# EAGLE board Sequencer-Memory-V2.1 (EAGLE 9.6.2)
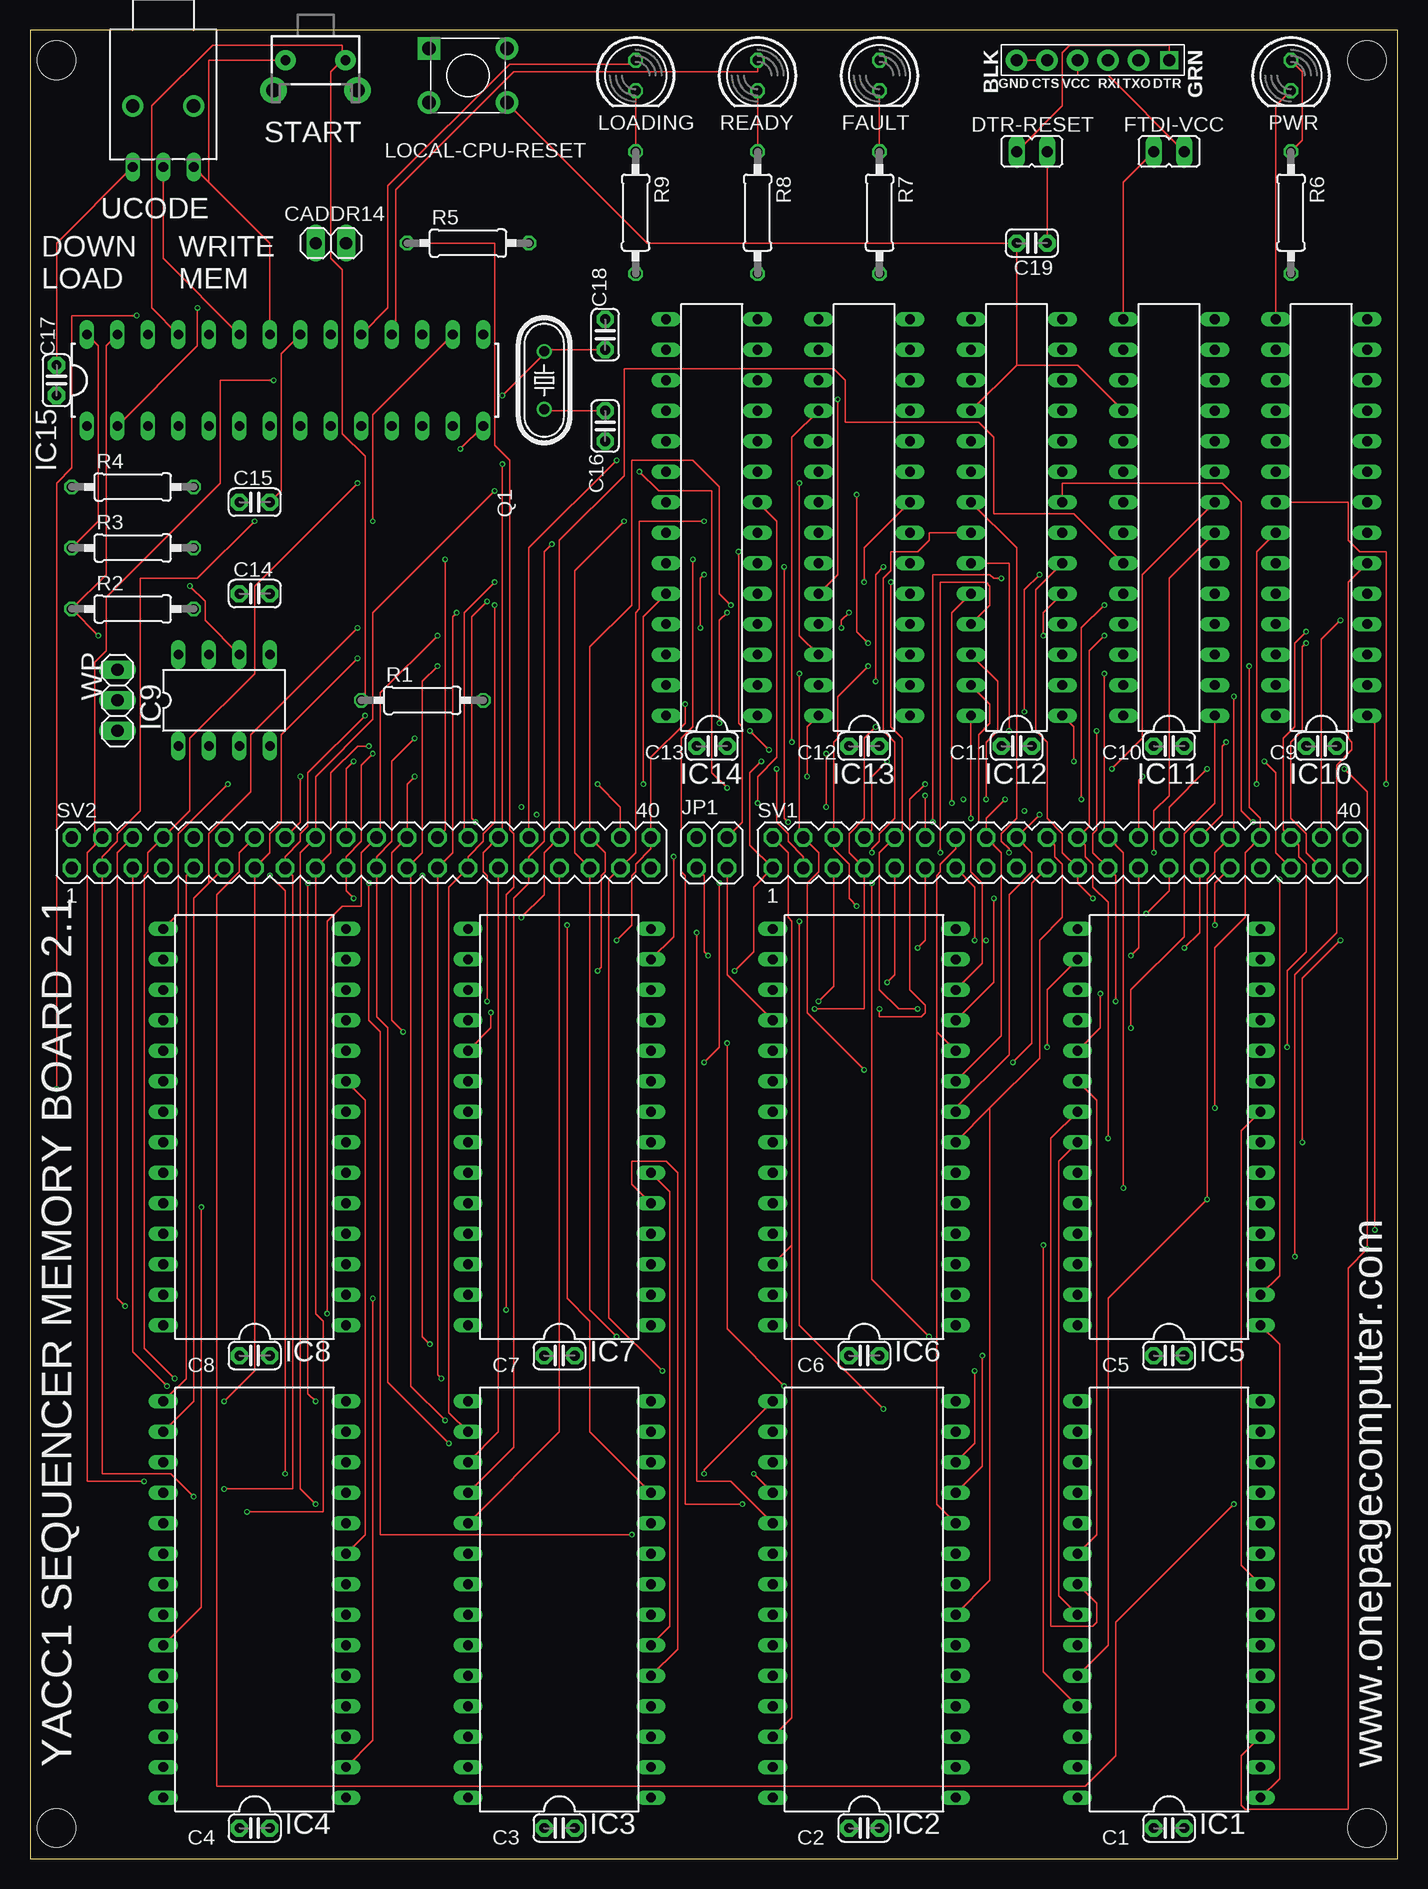
[diagram p4: board, top side]
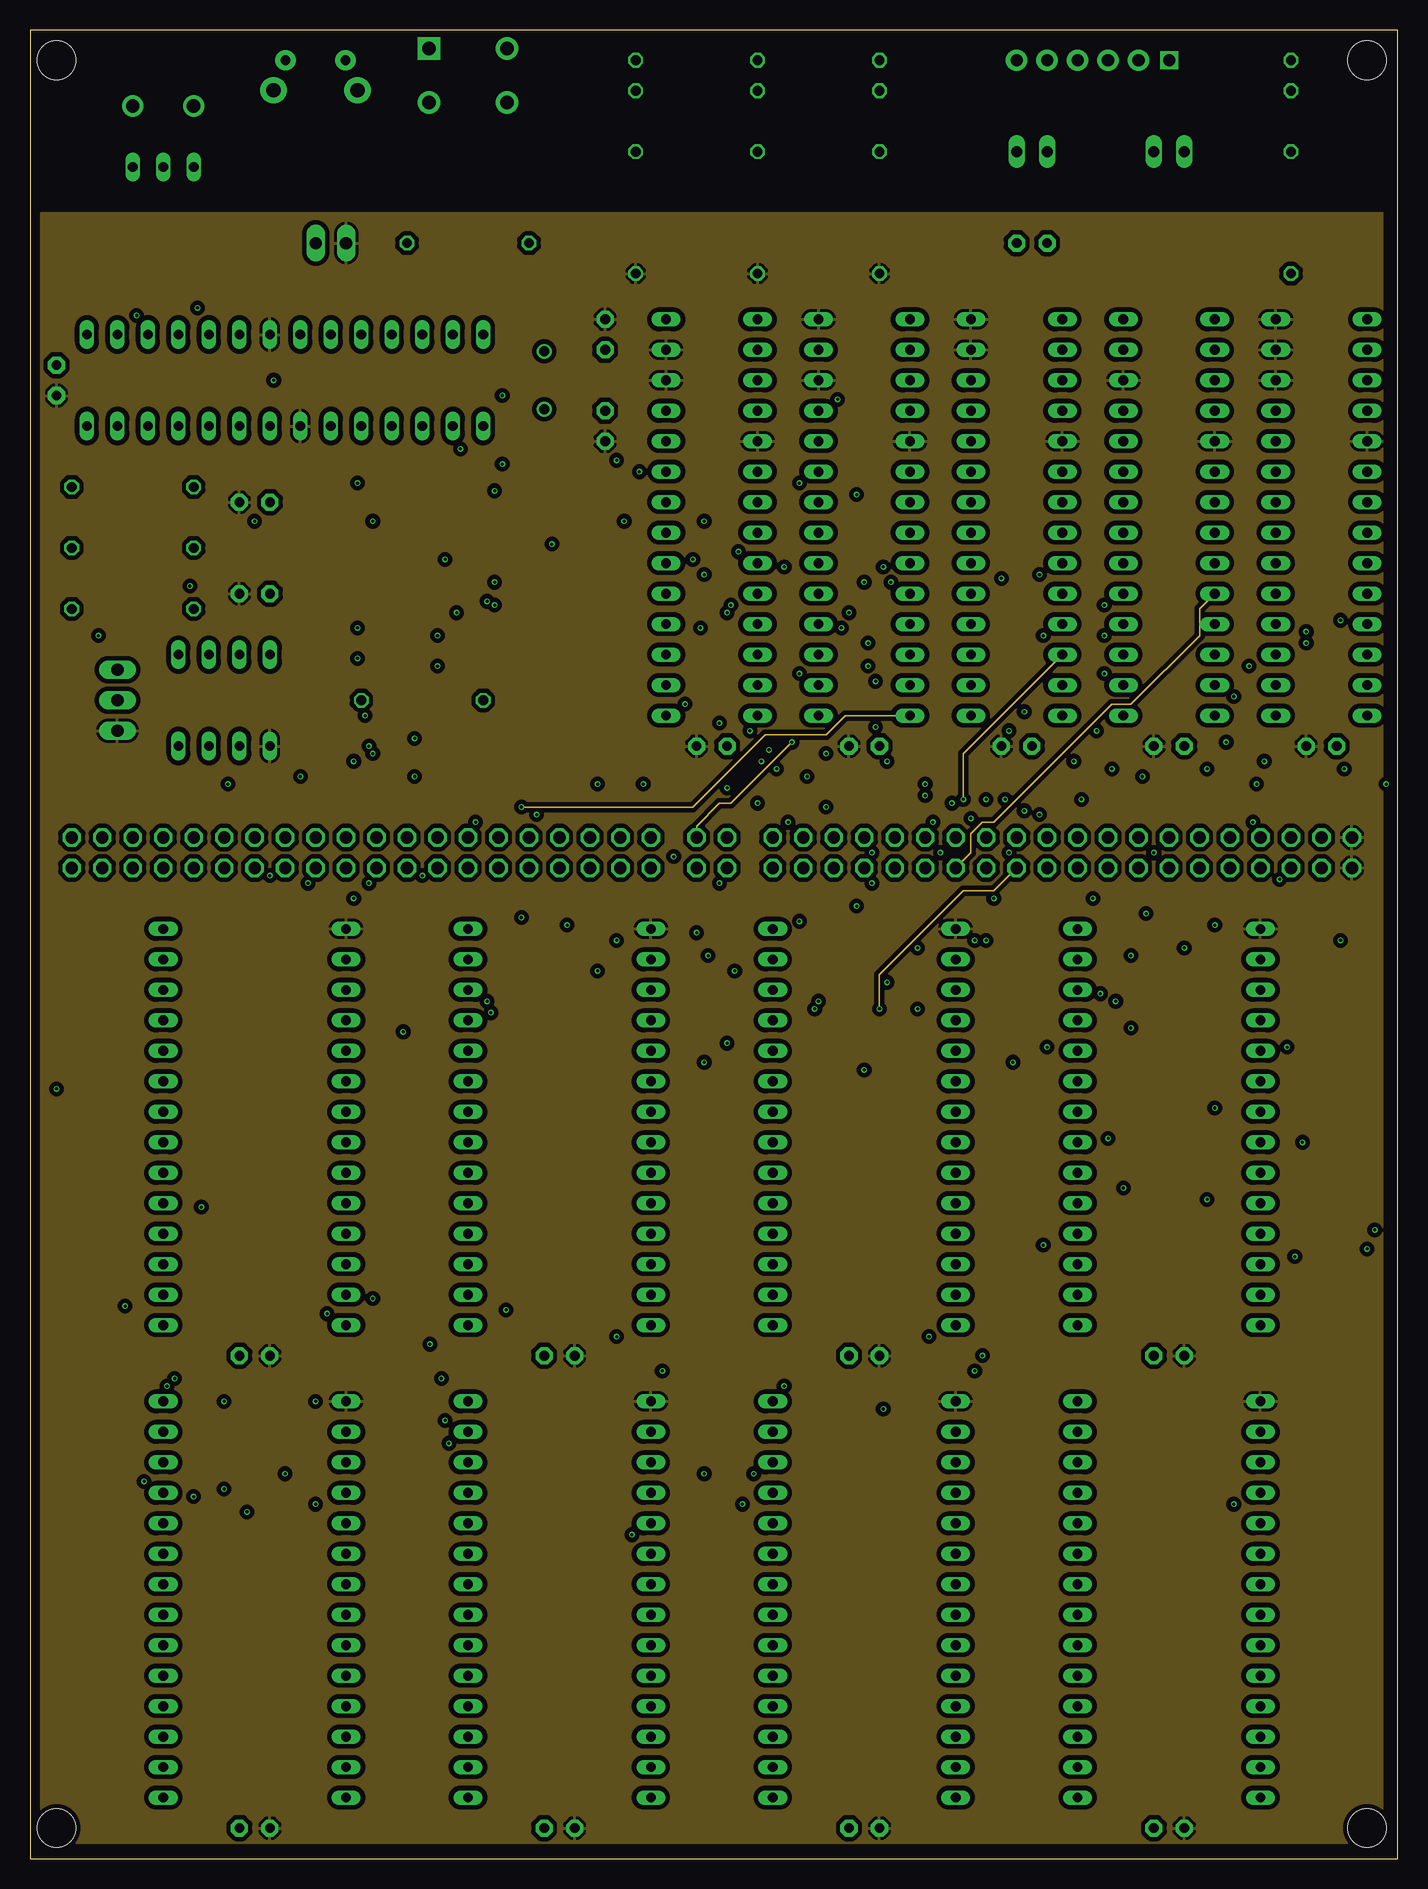
[diagram p5: board, inner layer Route2]
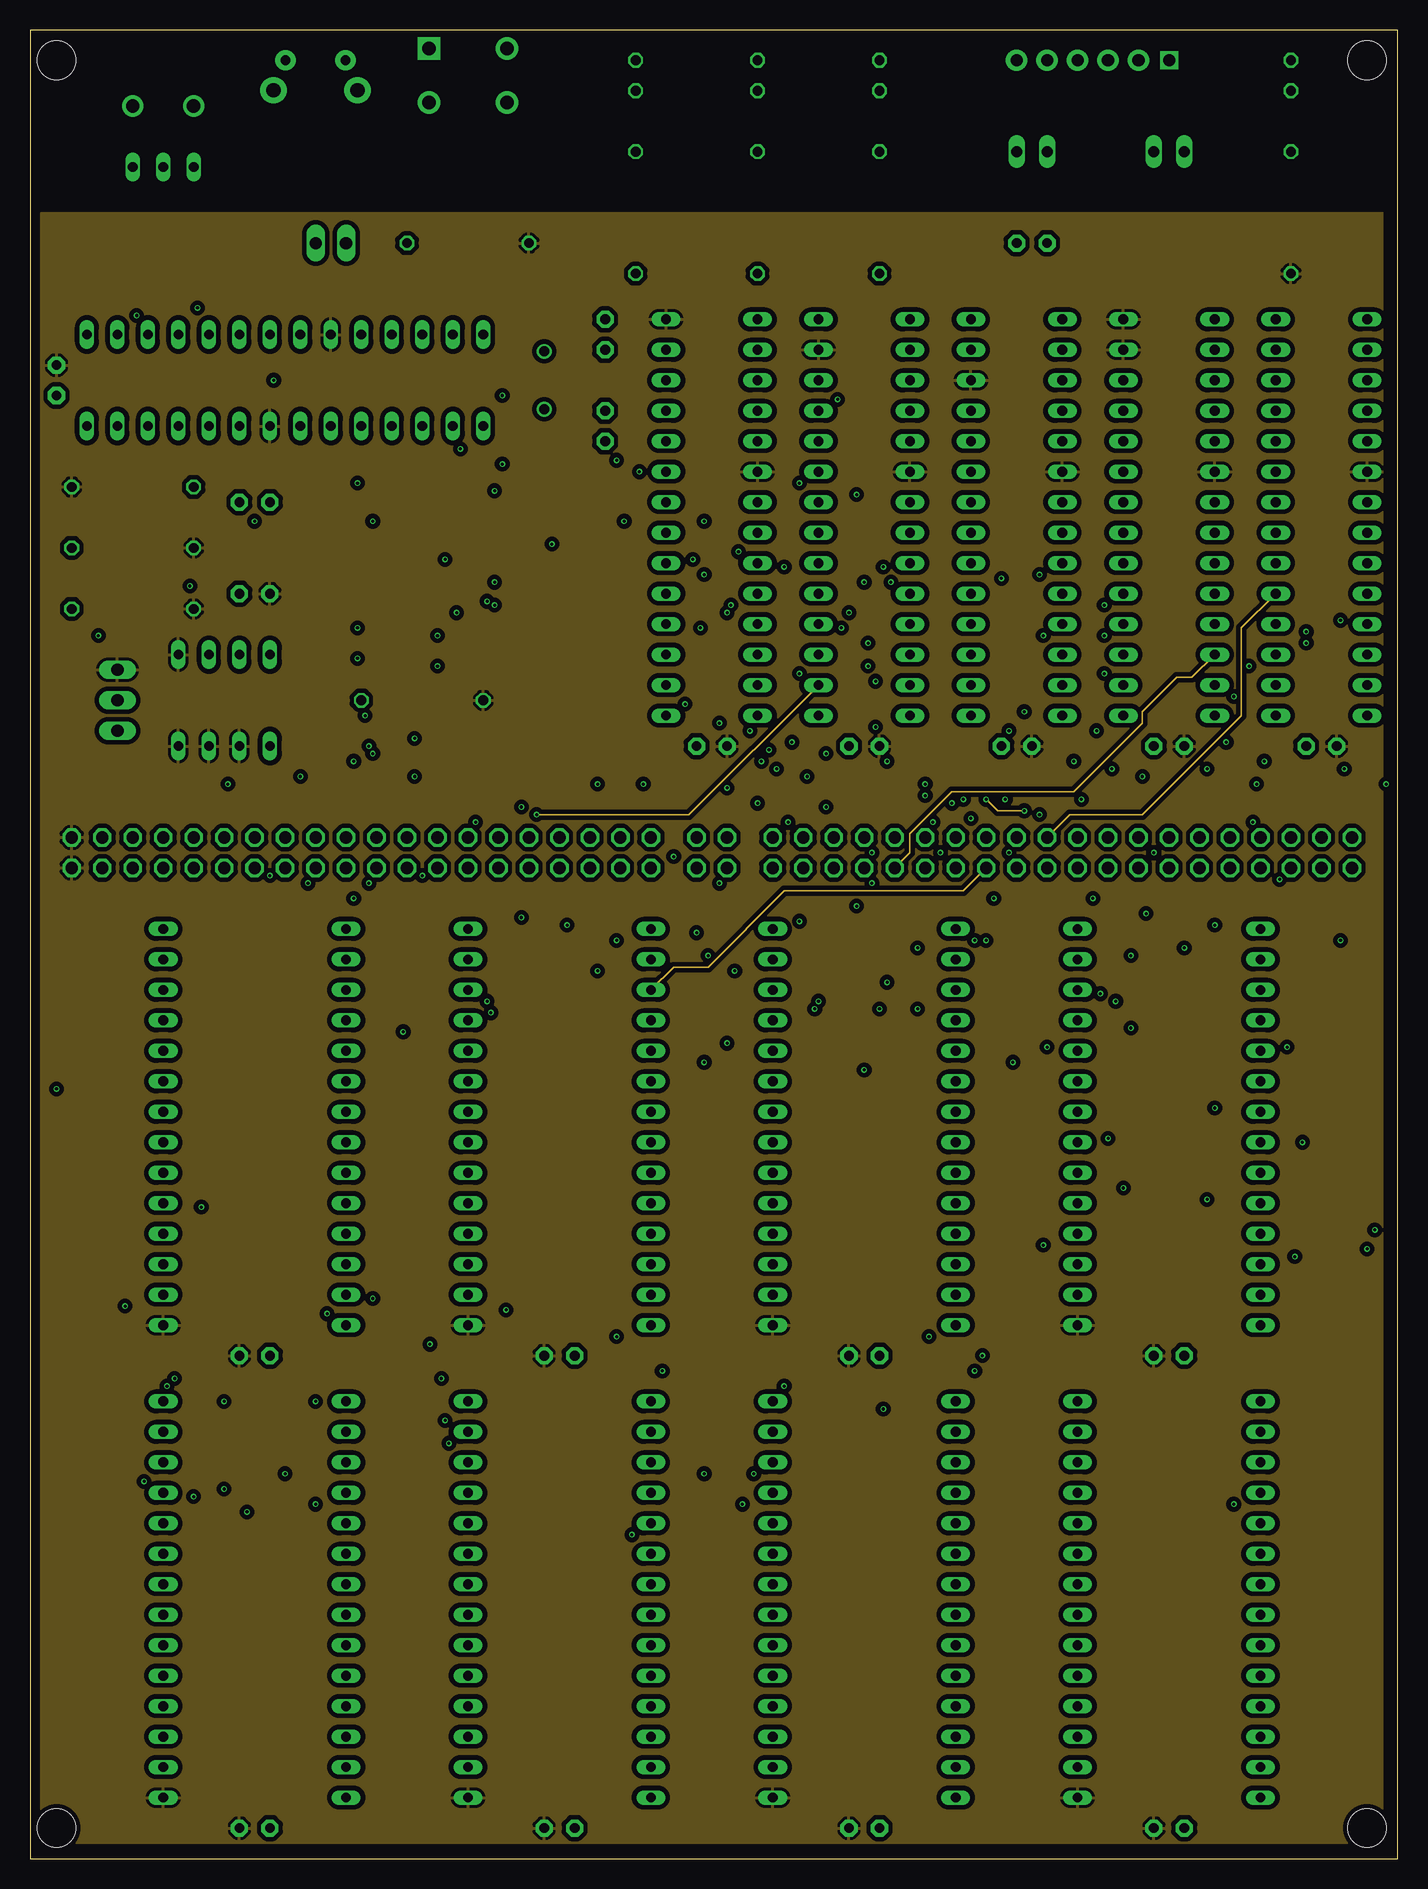
[diagram p6: board, inner layer Route15]
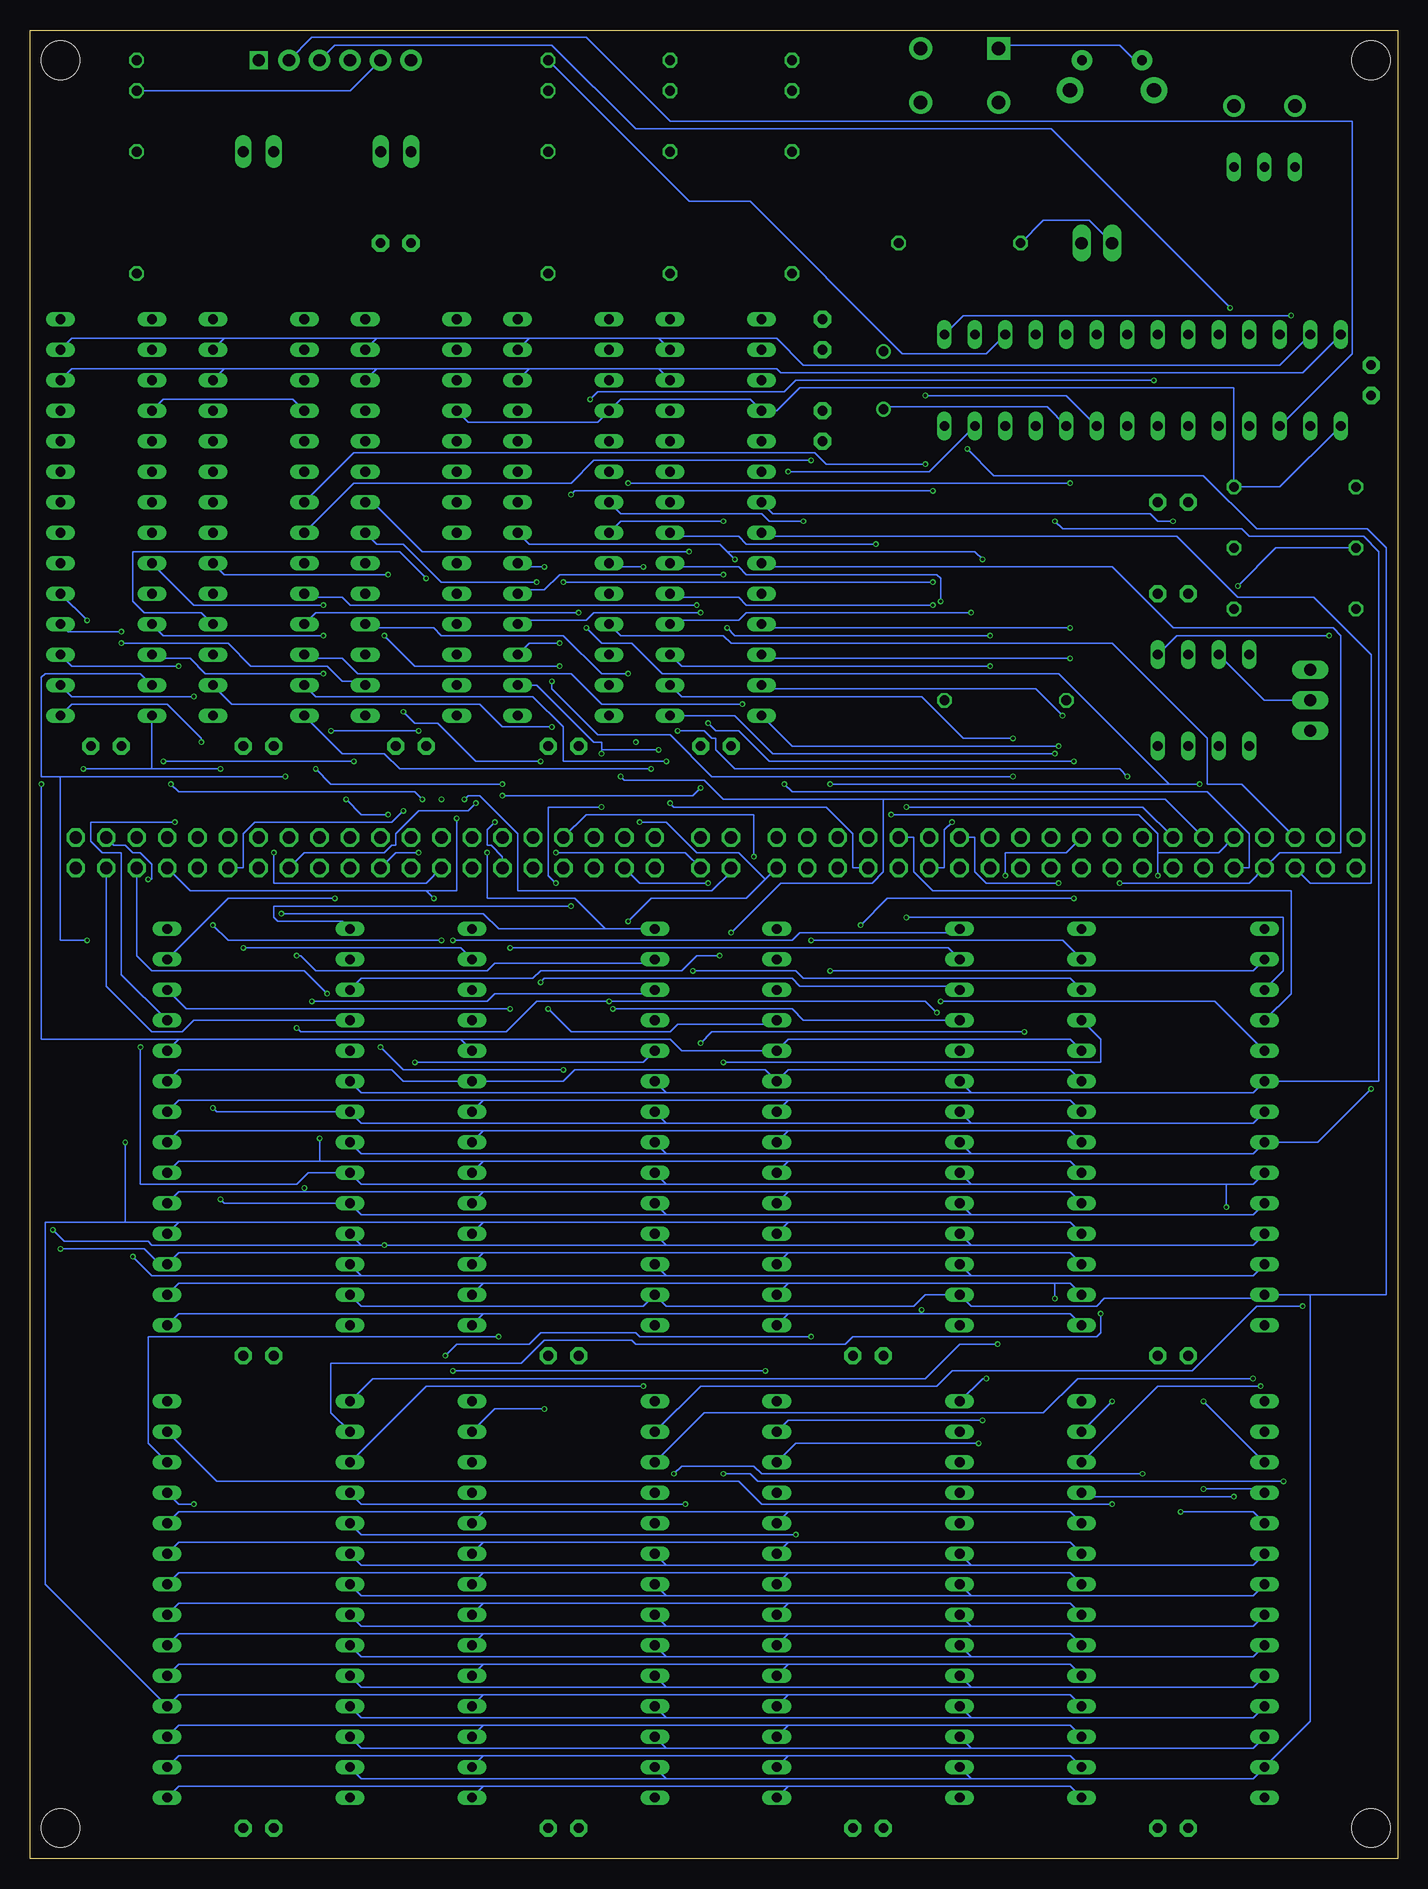
[diagram p7: board, bottom side, seen from below]

Size 113.97 x 152.38 mm. Coordinates in mm from the lower left corner, seen from the top.
Outline: 113.97,0 113.97,152.38 0,152.38 0,0 113.97,0
Copper layers (1*2*15*16): Top 0.035559375mm / dielectric 0.17018125mm / Route2 0.01778125mm / dielectric 47mil / Route15 0.01778125mm / dielectric 0.17018125mm / Bottom 0.035559375mm
Design rules "oshpark-4layer *": minimum track width 5mil, minimum drill 10mil, track to track 15mil, track to pad 10mil, pad to pad 10mil, via to via 5mil, smd to smd 5mil, copper to edge 15mil, drill to drill 6mil, minimum pad ring 4mil, minimum via ring 4mil, stop-mask expansion 2.5mil, vias tented up to drill 0mil, thermal gap 10mil
Holes 3.2 mm at 111.43,2.54 111.43,149.86 2.21,149.86 2.21,2.54

## Footprints (pad centres in the part's own frame; a part is rotated, then mirrored left to right if it is on the bottom)
C025-024X044 = drill 0.813 pad 1.422 octagon: 1 -1.27,0; 2 1.27,0
1X02 = drill 1.016 long: 1 -1.27,0; 2 1.27,0
JP1 = drill 0.914 long: 1 0,-1.27; 2 0,1.27
LED5MM = drill 0.813 octagon: A -1.27,0; K 1.27,0
DIL28-6 = drill 0.813 long: 1 -16.51,-7.62; 2 -13.97,-7.62; 3 -11.43,-7.62; 4 -8.89,-7.62; 5 -6.35,-7.62; 6 -3.81,-7.62; 7 -1.27,-7.62; 8 1.27,-7.62; 9 3.81,-7.62; 10 6.35,-7.62; 11 8.89,-7.62; 12 11.43,-7.62; 13 13.97,-7.62; 14 16.51,-7.62; 15 16.51,7.62; 16 13.97,7.62; 17 11.43,7.62; 18 8.89,7.62; 19 6.35,7.62; 20 3.81,7.62; 21 1.27,7.62; 22 -1.27,7.62; 23 -3.81,7.62; 24 -6.35,7.62; 25 -8.89,7.62; 26 -11.43,7.62; 27 -13.97,7.62; 28 -16.51,7.62
DIL8 = drill 0.813 long: 1 -3.81,-3.81; 2 -1.27,-3.81; 3 1.27,-3.81; 4 3.81,-3.81; 5 3.81,3.81; 6 1.27,3.81; 7 -1.27,3.81; 8 -3.81,3.81
DIL28-3 = drill 0.813 long: 1 -16.51,-3.81; 2 -13.97,-3.81; 3 -11.43,-3.81; 4 -8.89,-3.81; 5 -6.35,-3.81; 6 -3.81,-3.81; 7 -1.27,-3.81; 8 1.27,-3.81; 9 3.81,-3.81; 10 6.35,-3.81; 11 8.89,-3.81; 12 11.43,-3.81; 13 13.97,-3.81; 14 16.51,-3.81; 15 16.51,3.81; 16 13.97,3.81; 17 11.43,3.81; 18 8.89,3.81; 19 6.35,3.81; 20 3.81,3.81; 21 1.27,3.81; 22 -1.27,3.81; 23 -3.81,3.81; 24 -6.35,3.81; 25 -8.89,3.81; 26 -11.43,3.81; 27 -13.97,3.81; 28 -16.51,3.81
2X02 = drill 1.016 octagon: 1 -1.27,-1.27; 2 -1.27,1.27; 3 1.27,-1.27; 4 1.27,1.27
1X03 = drill 1.016 long: 1 -2.54,0; 2 0,0; 3 2.54,0
FTDI_DEVICE_SIDE = drill 1 square: P$1 -6.35,0 | drill 1.016 pad 1.778: P$2 -3.81,0; P$3 -1.27,0; P$4 1.27,0; P$5 3.81,0; P$6 6.35,0
SW4-6.2X6.2X5.0MM = drill 1.143 pad 1.905 square: 1 -3.25,2.25 | drill 1.143 pad 1.905: 2 -3.25,-2.25; 3 3.25,-2.25; 4 3.25,2.25
HC49/S = drill 0.813: 1 -2.413,0; 2 2.413,0
0207/10 = drill 0.813 octagon: 1 -5.08,0; 2 5.08,0
TACTILE-PTH-SIDEEZ = drill 0.8 pad 1.7: 1 -2.5,0; 2 2.5,0 | drill 1.2 pad 2.2: ANCHOR1 -3.5,2.5; ANCHOR2 3.5,2.5
MA20-2 = drill 1.016 octagon: 1 -24.13,-1.27; 2 -24.13,1.27; 3 -21.59,-1.27; 4 -21.59,1.27; 5 -19.05,-1.27; 6 -19.05,1.27; 7 -16.51,-1.27; 8 -16.51,1.27; 9 -13.97,-1.27; 10 -13.97,1.27; 11 -11.43,-1.27; 12 -11.43,1.27; 13 -8.89,-1.27; 14 -8.89,1.27; 15 -6.35,-1.27; 16 -6.35,1.27; 17 -3.81,-1.27; 18 -3.81,1.27; 19 -1.27,-1.27; 20 -1.27,1.27; 21 1.27,-1.27; 22 1.27,1.27; 23 3.81,-1.27; 24 3.81,1.27; 25 6.35,-1.27; 26 6.35,1.27; 27 8.89,-1.27; 28 8.89,1.27; 29 11.43,-1.27; 30 11.43,1.27; 31 13.97,-1.27; 32 13.97,1.27; 33 16.51,-1.27; 34 16.51,1.27; 35 19.05,-1.27; 36 19.05,1.27; 37 21.59,-1.27; 38 21.59,1.27; 39 24.13,-1.27; 40 24.13,1.27
9070-1W = drill 0.813 long: 1 5.08,-2.54; 2 5.08,0; 3 5.08,2.54 | drill 1.118 pad 1.778: B 0,-2.54; B1 0,2.54

## Placement (x,y rotation side)
C1  0.1  [C025-024X044]  94.92,2.54 180 top
C2  0.1  [C025-024X044]  69.52,2.54 180 top
C3  0.1  [C025-024X044]  44.12,2.54 180 top
C4  0.1  [C025-024X044]  18.72,2.54 180 top
C5  0.1  [C025-024X044]  94.92,41.91 180 top
C6  0.1  [C025-024X044]  69.52,41.91 180 top
C7  0.1  [C025-024X044]  44.12,41.91 180 top
C8  0.1  [C025-024X044]  18.72,41.91 180 top
C9  0.1  [C025-024X044]  107.62,92.71 0 top
C10  0.1  [C025-024X044]  94.92,92.71 0 top
C11  0.1  [C025-024X044]  82.22,92.71 0 top
C12  0.1  [C025-024X044]  69.52,92.71 0 top
C13  0.1  [C025-024X044]  56.82,92.71 0 top
C14  0.1  [C025-024X044]  18.72,105.41 0 top
C15  0.1  [C025-024X044]  18.72,113.03 0 top
C16  20pf  [C025-024X044]  47.93,119.38 90 top
C17  0.1  [C025-024X044]  2.21,123.19 90 top
C18  20pf  [C025-024X044]  47.93,127 270 top
C19  0.1  [C025-024X044]  83.49,134.62 180 top
CADDR14  PINHD-1X2  [1X02]  25.07,134.62 0 top
DTR-RESET  [JP1]  83.49,142.24 270 top
FAULT  [LED5MM]  70.79,148.59 270 top
FTDI-VCC  [JP1]  94.92,142.24 270 top
IC1  [DIL28-6]  94.92,21.59 90 top
IC2  [DIL28-6]  69.52,21.59 90 top
IC3  [DIL28-6]  44.12,21.59 90 top
IC4  [DIL28-6]  18.72,21.59 90 top
IC5  [DIL28-6]  94.92,60.96 90 top
IC6  [DIL28-6]  69.52,60.96 90 top
IC7  [DIL28-6]  44.12,60.96 90 top
IC8  [DIL28-6]  18.72,60.96 90 top
IC9  24AA01P  [DIL8]  16.18,96.52 0 top
IC10  MCP23017SP  [DIL28-3]  107.62,111.76 90 top
IC11  MCP23017SP  [DIL28-3]  94.92,111.76 90 top
IC12  MCP23017SP  [DIL28-3]  82.22,111.76 90 top
IC13  MCP23017SP  [DIL28-3]  69.52,111.76 90 top
IC14  MCP23017SP  [DIL28-3]  56.82,111.76 90 top
IC15  ATMEGA328P_PDIP  [DIL28-3]  21.26,123.19 0 top
JP1  PINHD-2X2  [2X02]  56.82,83.82 0 top
JP2  [1X03]  7.29,96.52 90 top
JP3  FTDI_DEVICE  [FTDI_DEVICE_SIDE]  88.57,149.86 180 top
LOADING  [LED5MM]  50.47,148.59 270 top
LOCAL-CPU-RESET  TS-1109-7  [SW4-6.2X6.2X5.0MM]  36.5,148.59 0 top
PWR  [LED5MM]  105.08,148.59 270 top
Q1  16Mhz  [HC49/S]  42.85,123.19 90 top
R1  10k  [0207/10]  32.69,96.52 0 top
R2  2.2k  [0207/10]  8.56,104.14 0 top
R3  2.2k  [0207/10]  8.56,109.22 0 top
R4  10k  [0207/10]  8.56,114.3 0 top
R5  10k  [0207/10]  36.5,134.62 0 top
R6  330  [0207/10]  105.08,137.16 270 top
R7  330  [0207/10]  70.79,137.16 270 top
R8  330  [0207/10]  60.63,137.16 270 top
R9  330  [0207/10]  50.47,137.16 270 top
READY  [LED5MM]  60.63,148.59 270 top
START  SWITCH-MOMENTARY-2SIDE_EZ  [TACTILE-PTH-SIDEEZ]  23.8,149.86 180 top
SV1  [MA20-2]  86.03,83.82 0 top
SV2  [MA20-2]  27.61,83.82 0 top
UCODE  [9070-1W]  11.1,146.05 270 top

## Tracks (layer width: path | path; a pad name or v marks a point on that pad's centre or on a via)
-2-BYTE-OPERAND-SEL  (via drill 0.25)
  Top 0.127: v73.97,70.8 72.38,70.8 70.79,72.39 70.79,83.82 SV1.10 72.7,85.72 72.7,93.34 71.74,94.3 v71.74,106.36
  Bottom 0.127: IC5.12 100.95,70.8 v73.97,70.8 | IC12.7 85.08,109.54 82.86,109.54 79.68,106.36 v71.74,106.36
-AC-LD  (via drill 0.25)
  Top 0.127: v65.39,70.8 69.52,70.8 SV1.7 68.25,83.82 68.25,85.41 69.52,86.68 69.52,93.34 v70.47,94.3
  Bottom 0.127: IC7.18 49.52,69.85 50.47,70.8 v65.39,70.8 | IC11.2 97.14,96.2 76.5,96.2 74.6,94.3 v70.47,94.3
-AC-LD-INV  (via drill 0.25)
  Top 0.127: v56.19,66.36 57.45,67.63 v57.45,81.28 | v62.22,90.81 62.22,86.36 63.17,85.41 63.17,84.77 64.44,83.5 SV1.3
  Bottom 0.127: IC8.11 24.75,68.26 24.75,66.36 v56.19,66.36 | v57.45,81.28 63.17,81.28 SV1.3 | IC11.28 87.94,92.08 84.44,92.08 83.17,90.81 v62.22,90.81
-AC-RD  (via drill 0.25)
  Top 0.127: IC7.19 38.41,69.22 v38.41,70.48 | v65.71,71.44 66.98,72.71 SV1.5 | IC11.1 98.73,87.95 96.19,85.41 96.19,76.83 91.75,72.39 v91.75,69.22
  Bottom 0.127: v38.41,70.48 39.36,71.44 v65.71,71.44 71.74,71.44 74.28,68.9 91.43,68.9 v91.75,69.22
-ALU-FUNC  (via drill 0.25)
  Top 0.127: v40.95,78.42 42.85,80.33 42.85,83.82 SV2.34 44.12,109.86 49.52,115.25 49.52,124.14 66.98,124.14 67.93,123.19 67.93,119.7 79.05,119.7 80.31,118.43 80.31,112.08 86.98,112.08 IC11.23
  Bottom 0.127: IC8.17 9.51,73.98 9.51,78.42 v40.95,78.42
-CMEMRD  (via drill 0.25)
  Top 0.127: v8.88,128.59 3.48,128.59 3.48,115.89 2.21,114.62 v2.21,64.14 | IC1.22 85.71,21.91 85.71,58.1 IC5.22
  Bottom 0.127: IC4.22 12.05,19.37 35.55,19.37 | IC3.22 35.55,19.37 | 60.95,19.37 IC2.22 | 35.55,19.37 60.95,19.37 | IC1.22 86.35,19.37 60.95,19.37 | 35.55,58.74 12.05,58.74 IC8.22 6.66,59.69 v2.21,64.14 | IC7.22 35.55,58.74 | IC15.15 36.18,128.59 v8.88,128.59 | 60.95,58.74 IC6.22 | 35.55,58.74 60.95,58.74 | IC5.22 86.35,58.74 60.95,58.74
-CMEMSEL  (via drill 0.25)
  Top 0.127: IC15.16 28.56,120.33 v28.56,111.44 | IC1.20 88.89,26.99 88.89,63.18 IC5.20
  Bottom 0.127: IC4.20 12.05,24.45 35.55,24.45 | IC3.20 35.55,24.45 | 60.95,24.45 IC2.20 | 35.55,24.45 60.95,24.45 | IC1.20 86.35,24.45 60.95,24.45 | 35.55,63.82 12.05,63.82 IC8.20 1.57,64.77 1.57,108.9 2.84,110.17 12.37,110.17 13.01,110.81 27.93,110.81 v28.56,111.44 | IC7.20 35.55,63.82 | 60.95,63.82 IC6.20 | 35.55,63.82 60.95,63.82 | IC5.20 86.35,63.82 60.95,63.82
-CMEMWR  (via drill 0.25)
  Top 0.127: v35.87,117.47 IC15.14
  Bottom 0.127: 35.55,6.67 12.05,6.67 IC4.27 7.29,11.43 7.29,46.99 | IC3.27 35.55,6.67 | 60.95,6.67 IC2.27 | 35.55,6.67 60.95,6.67 | IC1.27 86.35,6.67 60.95,6.67 | IC5.27 86.35,46.04 62.85,46.04 IC6.27 60.95,46.04 40.31,46.04 39.36,46.99 IC7.27 35.55,46.04 25.07,46.04 24.44,46.67 11.42,46.67 IC8.27 7.29,46.99 | v35.87,117.47 33.64,115.25 16.18,115.25 11.73,110.81 2.53,110.81 0.94,109.22 0.94,46.99 7.29,46.99
-HL-SWAP  (via drill 0.25)
  Top 0.127: v78.73,76.52 78.73,80.96 SV1.13
  Route2 0.127: IC11.5 97.46,104.14 97.46,101.92 91.75,96.2 90.16,96.2 80.31,86.36 79.36,86.36 78.41,85.41 78.41,83.82 SV1.13
  Bottom 0.127: IC7.15 36.82,77.15 49.84,77.15 50.47,76.52 v78.73,76.52
-INT-JMP  (via drill 0.25)
  Top 0.127: v68.89,79.38 68.25,80.01 68.25,82.87 66.98,84.14 SV1.6 66.98,93.03 67.3,93.34 67.3,96.84 v69.84,99.38 | IC12.5 84.44,103.82 v84.44,101.92
  Bottom 0.127: IC5.15 87.94,78.11 93.33,78.11 93.65,78.42 93.65,79.38 v68.89,79.38 | v84.44,101.92 81.9,99.38 v69.84,99.38
-INTA  (via drill 0.25)
  Top 0.127: v81.9,66.36 83.49,67.94 83.49,81.28 SV1.19 | IC12.21 82.22,109.22 82.22,86.68 80.95,85.41 80.95,84.77 81.59,84.14 v81.59,83.82
  Bottom 0.127: IC6.19 62.85,66.36 v81.9,66.36 | v81.59,83.82 83.49,83.82 SV1.19
-IO-ADDR-LD  (via drill 0.25)
  Top 0.127: v38.09,71.44 38.09,81.92 37.77,82.23 37.77,83.82 SV2.30 39.36,85.41 v39.36,116.2
  Bottom 0.127: IC8.19 15.23,71.44 v38.09,71.44 | IC11.21 86.98,117.16 48.57,117.16 47.61,116.2 v39.36,116.2
-IO-RD  (via drill 0.25)
  Top 0.127: v71.11,37.47 64.12,44.45 v64.12,78.11 | v62.85,107.63 62.85,86.68 v63.17,86.36
  Bottom 0.127: IC2.13 75.23,37.47 v71.11,37.47 | v64.12,78.11 62.22,80.01 54.28,80.01 52.69,81.6 | SV2.39 52.69,81.6 | IC13.23 65.39,107.63 v62.85,107.63 | v63.17,86.36 60.95,86.36 58.41,83.82 54.91,83.82 52.69,81.6
-IO-WR  (via drill 0.25)
  Top 0.127: IC2.15 56.19,32.38 v56.19,32.07 | v9.51,31.43 4.75,31.43 4.75,83.82 5.38,84.45 | SV2.4 5.38,84.45 | IC13.24 67.3,107 v67.3,121.6 | v20.31,123.19 15.86,123.19 15.86,114.62 6.34,105.09 6.34,100.65 5.38,99.69 5.38,84.45
  Bottom 0.127: v56.19,32.07 53.96,32.07 53.33,31.43 v9.51,31.43 | v67.3,121.6 66.66,122.24 51.11,122.24 50.15,123.19 v20.31,123.19
-MEM-CPU-RESET  (via drill 0.25)
  Top 0.127: 82.22,124.46 IC12.18 | 82.22,124.46 C19.2 51.42,134.62 39.99,146.05 LOCAL-CPU-RESET.3 | IC11.18 87.3,124.46 82.22,124.46 | v63.49,93.03 63.49,118.43 IC13.18
  Route2 0.127: JP1.2 55.55,86.04 57.45,87.95 58.41,87.95 v63.49,93.03
  Bottom 0.127: IC10.18 102.86,121.6 92.06,121.6 IC11.18 | IC15.1 9.83,114.3 R4.2 13.64,122.56 49.84,122.56 51.74,120.65 IC14.18 53.96,121.6 64.76,121.6 IC13.18 66.66,119.7 77.46,119.7 IC12.18
-MEM-RD  (via drill 0.25)
  Top 0.127: IC2.11 79.36,32.7 v79.36,41.91 | v48.88,43.5 46.66,45.72 SV2.35 45.39,83.82 45.39,107.31 v49.52,111.44
  Bottom 0.127: v79.36,41.91 78.41,42.86 72.38,42.86 71.42,43.81 63.49,43.81 63.17,43.5 v48.88,43.5 | IC13.21 64.76,112.08 53.01,112.08 52.38,111.44 v49.52,111.44
-MEM-WR  (via drill 0.25)
  Top 0.127: IC2.12 78.73,34.61 v78.73,40.64 | v52.69,40.64 48.25,45.09 48.25,81.6 SV2.37 50.47,83.82 50.47,103.82 50.79,104.14 50.79,111.44 v56.19,111.44
  Bottom 0.127: v52.69,40.64 v78.73,40.64 | IC13.22 64.76,111.44 v56.19,111.44
-REG-DN  (via drill 0.25)
  Top 0.127: IC3.18 40.31,34.29 40.31,80.01 41.58,81.28 SV2.31 41.58,83.5 42.85,84.77 42.85,108.9 v43.48,109.54
  Bottom 0.127: IC14.7 60.31,110.17 54.91,110.17 54.28,109.54 v43.48,109.54
-REG-FUNC-LD  (via drill 0.25)
  Top 0.127: v11.42,39.37 8.56,42.23 SV2.5
  Bottom 0.127: IC4.12 19.99,39.37 v11.42,39.37 | IC14.22 52.69,110.17 18.4,110.17 13.32,105.09 6.97,105.09 2.21,100.33 2.21,81.28 7.29,81.28 SV2.5
-REG-FUNC-RD  (via drill 0.25)
  Top 0.127: v13.64,30.16 11.73,32.07 6.02,32.07 SV2.3 6.02,83.5 7.29,84.77 7.29,85.41 9.2,87.31 9.2,106.68 13.96,106.68 v18.72,111.44
  Bottom 0.127: IC4.11 26.02,30.16 v13.64,30.16 | IC14.21 52.06,112.08 20.62,112.08 19.99,111.44 v18.72,111.44
-REG-RD-HI  (via drill 0.25)
  Top 0.127: IC3.16 34.91,37.15 34.91,80.96 SV2.27 36.5,83.5 37.77,84.77 37.77,85.41 38.72,86.36 v38.72,104.46
  Bottom 0.127: IC14.5 60.31,105.09 54.91,105.09 54.28,104.46 v38.72,104.46
-REG-RD-LO  (via drill 0.25)
  Top 0.127: v34.59,36.51 31.74,39.37 31.74,82.23 SV2.23 32.69,83.82 32.69,98.11 v33.96,99.38
  Bottom 0.127: IC3.13 50.79,36.51 v34.59,36.51 | IC14.3 59.68,99.38 v33.96,99.38
-REG-UP  (via drill 0.25)
  Top 0.127: IC3.19 44.12,35.56 SV2.33 | IC14.8 62.22,111.44 62.22,91.76 60.63,90.17 v60.63,87.95
  Bottom 0.127: v60.63,87.95 60.31,87.63 47.61,87.63 45.39,85.41 45.39,82.55 SV2.33
-SR-LD  (via drill 0.25)
  Top 0.127: v71.42,73.03 72.06,73.66 SV1.9
  Route15 0.127: IC11.3 96.83,98.42 95.56,98.42 92.7,95.57 92.7,94.61 86.98,88.9 76.82,88.9 73.33,85.41 73.33,83.82 SV1.9
  Bottom 0.127: IC7.17 36.82,72.71 49.84,72.71 50.47,73.34 71.11,73.34 v71.42,73.03
-TMP-REG-LD0  (via drill 0.25)
  Top 0.127: v12.05,40.01 9.51,42.55 9.51,81.92 9.83,82.23 9.83,83.82 SV2.8 13.32,87.31 13.32,93.34 18.72,98.74 18.72,106.05 v27.29,114.62 | IC13.26 64.12,101.92 v64.12,114.62
  Bottom 0.127: IC2.17 57.77,37.15 29.52,37.15 26.66,40.01 v12.05,40.01 | v27.29,114.62 v64.12,114.62
-TMP-REG-LD1  (via drill 0.25)
  Top 0.127: IC2.19 58.41,31.43 55.55,31.43 v55.55,77.15 | IC13.28 64.76,94.3 v64.76,90.17
  Bottom 0.127: v55.55,77.15 51.42,81.28 43.8,81.28 42.85,82.23 42.85,88.27 | 42.85,88.27 19.36,88.27 SV2.12 | v64.76,90.17 64.44,89.85 57.77,89.85 56.19,88.27 42.85,88.27
-TMP-REG-RD0  (via drill 0.25)
  Top 0.127: v7.93,46.04 7.29,46.67 7.29,83.82 SV2.6
  Bottom 0.127: IC2.16 58.09,39.37 38.41,39.37 37.14,40.64 17.13,40.64 11.73,46.04 v7.93,46.04 | IC13.25 64.76,101.92 56.19,101.92 55.55,101.28 23.8,101.28 15.86,93.34 15.86,89.53 13.01,89.53 SV2.6
-TMP-REG-RD1  (via drill 0.25)
  Top 0.127: v60.31,32.07 IC2.18 | v21.26,32.07 21.26,80.64 v19.99,81.92
  Route15 0.127: IC13.27 54.91,87 v42.22,87
  Bottom 0.127: v60.31,32.07 59.68,32.7 53.65,32.7 53.01,32.07 v21.26,32.07 | 19.99,83.82 v19.99,81.92 | 19.99,83.82 14.91,83.82 SV2.10 | v42.22,87 21.58,87 19.99,85.41 19.99,83.82
-VMA  (via drill 0.25)
  Top 0.127: v48.88,116.52 41.58,109.22 SV2.32
  Bottom 0.127: IC8.18 8.88,72.07 8.88,80.64 38.72,80.64 40.31,82.23 40.31,85.09 SV2.32 | IC11.22 86.98,114.62 68.89,114.62 66.98,116.52 v48.88,116.52
ADDR-REG-ID0  (via drill 0.25)
  Top 0.127: v100.32,29.53 90.48,19.68 90.48,8.57 87.94,6.03 15.54,6.03 15.54,80.33 17.45,82.23 17.45,83.82 SV2.14
  Route2 0.127: IC13.1 67.93,95.25 66.34,93.66 61.27,93.66 55.23,87.63 v40.95,87.63
  Bottom 0.127: IC1.11 101.59,29.53 v100.32,29.53 | v40.95,87.63 21.26,87.63 SV2.14
ADDR-REG-ID1  (via drill 0.25)
  Top 0.127: v74.92,43.5 70.16,48.26 v70.16,81.28 | v66.34,92.08 v66.34,87.63 | SV2.16 22.53,86.36 v22.53,90.17 | v61.58,92.39 v60,93.98
  Bottom 0.127: IC1.12 104.13,34.61 104.13,43.5 v74.92,43.5 | v70.16,81.28 70.79,81.92 70.79,87.63 v66.34,87.63 | 66.34,92.39 66.34,93.03 66.98,93.03 71.74,97.79 IC13.2 | 66.34,92.39 v66.34,92.08 | v22.53,90.17 23.17,90.81 55.23,90.81 56.82,92.39 56.82,93.34 57.14,93.34 57.77,93.98 v60,93.98 | 66.34,92.39 v61.58,92.39
ADDR-REG-ID2  (via drill 0.25)
  Top 0.127: v23.8,29.53 22.53,30.8 22.53,83.82 SV2.18 23.8,90.17 28.56,94.93 28.56,103.82 v38.72,113.98 | v69.84,101.28 68.89,102.23 v68.89,113.67
  Bottom 0.127: IC1.13 98.41,31.43 54.91,31.43 53.01,29.53 v23.8,29.53 | IC13.3 72.38,101.28 v69.84,101.28 | v68.89,113.67 68.57,113.98 v38.72,113.98
ADDR-REG-ID3  (via drill 0.25)
  Top 0.127: v33.33,42.86 32.69,43.5 v32.69,81.92 | v58.09,103.82 57.45,103.19 v57.45,94.61 | v26.98,91.44 26.34,90.81 SV2.20
  Bottom 0.127: IC1.15 85.39,40.01 39.36,40.01 36.5,42.86 v33.33,42.86 | v32.69,81.92 32.69,83.82 27.61,83.82 SV2.20 | IC13.4 73.01,103.19 67.61,103.19 66.98,103.82 v58.09,103.82 | v57.45,94.61 56.82,93.98 54.91,93.98 52.38,91.44 v26.98,91.44
ALU0  (via drill 0.25)
  Top 0.127: v47.3,73.98 47.61,74.3 47.61,81.92 47.93,82.23 47.93,83.82 SV2.36 46.66,100.97 50.15,104.46 50.15,116.52 55.23,116.52 57.45,114.3 57.45,105.41 v58.41,104.46
  Bottom 0.127: IC8.16 12.05,73.98 v47.3,73.98 | IC11.24 90.79,105.09 87.94,105.09 87.3,104.46 v58.41,104.46
ALU1  (via drill 0.25)
  Top 0.127: IC8.15 12.37,78.74 12.37,85.41 v16.5,89.53 | v47.3,89.53 49.2,87.63 SV2.38 | v68.25,103.82 67.61,103.19 v67.61,102.55
  Bottom 0.127: v47.3,89.53 19.04,89.53 | 19.04,89.53 v16.5,89.53 | IC11.25 90.16,103.82 v68.25,103.82 | v67.61,102.55 66.34,101.28 63.81,101.28 61.27,98.74 28.25,98.74 19.04,89.53
ALU2  (via drill 0.25)
  Top 0.127: v48.88,76.52 50.15,77.79 50.15,81.92 50.47,82.23 50.47,82.87 51.74,84.14 SV2.40 51.74,91.76 54.6,94.61 v54.6,96.2
  Bottom 0.127: IC8.13 27.93,76.52 v48.88,76.52 | IC11.26 90.79,100.01 87.94,100.01 86.67,98.74 68.89,98.74 66.34,96.2 v54.6,96.2
ALU3  (via drill 0.25)
  Top 0.127: v58.73,73.98 60.31,75.56 60.31,80.96 SV1.1 60,84.45 60,90.49 v60.95,91.44
  Bottom 0.127: IC8.12 27.29,73.34 49.52,73.34 50.15,73.98 v58.73,73.98 | IC11.27 90.16,96.84 72.06,96.84 69.52,94.3 69.52,91.44 v60.95,91.44
ARD-RXIN  (via drill 0.25)
  Top 0.127: IC15.2 13.96,126.05 v13.96,129.22
  Bottom 0.127: v13.96,129.22 28.88,144.15 63.49,144.15 70.47,151.13 88.57,151.13 JP3.P$3
ARD-TXOUT
  Bottom 0.127: IC15.3 3.8,125.41 3.8,144.78 60.63,144.78 67.61,151.76 90.48,151.76 JP3.P$2
BR-TEST  (via drill 0.25)
  Top 0.127: v73.97,75.88 74.6,76.52 SV1.11 | v80.95,106.68 80.31,106.68 80,107 75.23,107 v75.23,86.36
  Bottom 0.127: IC7.16 37.45,75.88 v73.97,75.88 | IC11.4 99.68,103.82 104.45,103.82 105.4,104.78 105.4,108.9 83.17,108.9 v80.95,106.68 | v75.23,86.36 75.87,85.72 75.87,84.45 75.55,84.45 74.6,83.5 SV1.11
BRANCH-LD-HI  (via drill 0.25)
  Top 0.127: IC5.16 84.76,72.39 v84.76,67.63 | v69.52,65.72 64.76,70.48 64.76,81.28 65.71,82.23 65.71,83.82 SV1.4 64.12,85.41 v64.12,98.74
  Bottom 0.127: v84.76,67.63 82.86,65.72 v69.52,65.72 | IC12.4 85.71,102.55 80.31,102.55 79.68,101.92 69.52,101.92 66.34,98.74 v64.12,98.74
BRANCH-LD-LO  (via drill 0.25)
  Top 0.127: v106.35,101.28 106.03,100.97 106.03,93.98 105.08,93.03 105.08,86.68 106.35,85.41 106.35,83.82 SV1.37
  Bottom 0.127: IC5.18 100.32,69.85 101.27,68.9 103.81,68.9 107.62,72.71 SV1.37 | IC12.2 86.35,98.11 87.94,98.11 89.2,99.38 95.56,99.38 97.46,101.28 v106.35,101.28
BRANCH-RD  (via drill 0.25)
  Top 0.127: IC5.19 89.2,69.22 v89.2,72.07 | IC12.1 86.98,94.3 v86.98,91.44 | v102.86,91.44 103.81,90.49 103.81,83.82 SV1.35
  Bottom 0.127: v89.2,72.07 91.11,73.98 103.81,73.98 105.08,75.25 SV1.35 | v102.86,91.44 v86.98,91.44
BUS-READY  (via drill 0.25)
  Top 0.127: v50.79,115.57 52.38,113.98 56.82,113.98 56.82,90.49 v58.09,89.22 | SV1.12 v74.6,88.58
  Bottom 0.127: IC15.13 39.04,115.57 v50.79,115.57 | v58.09,89.22 58.73,88.58 v74.6,88.58
CADDR0  (via drill 0.25)
  Top 0.127: 75.55,68.9 IC6.10 | 75.55,68.9 75.55,81.92 75.87,82.23 75.87,82.87 77.14,84.14 SV1.14 | IC10.21 109.84,113.03 109.84,109.86 110.8,108.9 113.02,108.9 v113.02,89.53 | IC2.10 75.55,29.53 75.55,68.9
  Bottom 0.127: IC4.10 27.29,28.89 50.79,28.89 | IC3.10 50.79,28.89 | 76.19,28.89 IC2.10 | 50.79,28.89 76.19,28.89 | IC1.10 101.59,28.89 76.19,28.89 | IC8.10 27.29,68.26 50.79,68.26 IC7.10 59.68,67.31 60.63,68.26 78.09,68.26 | 101.59,68.26 IC5.10 | 78.09,68.26 101.59,68.26 | IC6.10 78.09,68.26 | v113.02,89.53 113.02,68.26 101.59,68.26
CADDR1  (via drill 0.25)
  Top 0.127: IC6.9 80.95,68.58 80.95,83.82 SV1.16 79.68,86.68 v81.27,88.27 | IC10.22 102.22,108.9 v102.22,89.53 | IC4.9 27.93,26.99 27.93,63.18 IC8.9
  Bottom 0.127: IC4.9 27.29,26.35 50.79,26.35 | IC3.9 50.79,26.35 | 76.19,26.35 IC2.9 | 50.79,26.35 76.19,26.35 | IC1.9 101.59,26.35 76.19,26.35 | IC8.9 27.29,65.72 50.79,65.72 IC7.9 52.69,65.72 68.57,65.72 69.52,64.77 IC6.9 82.86,64.77 83.81,65.72 101.59,65.72 IC5.9 | v102.22,89.53 101.59,88.9 81.9,88.9 v81.27,88.27
CADDR2  (via drill 0.25)
  Top 0.127: v89.52,104.46 87.62,102.55 v87.62,88.27 | v84.12,87 SV1.18 83.49,83.82 83.49,82.23 81.59,80.33 81.59,66.99 77.14,62.55 IC6.8 | IC1.8 100.95,24.45 100.95,60.64 IC5.8
  Bottom 0.127: IC4.8 27.29,23.81 50.79,23.81 | IC3.8 50.79,23.81 | 76.19,23.81 IC2.8 | 50.79,23.81 76.19,23.81 | IC1.8 101.59,23.81 76.19,23.81 | IC10.23 100.32,104.46 v89.52,104.46 | v87.62,88.27 86.35,87 v84.12,87 | IC8.8 27.29,63.18 50.79,63.18 | IC7.8 50.79,63.18 | 76.19,63.18 IC6.8 | 50.79,63.18 76.19,63.18 | IC5.8 101.59,63.18 76.19,63.18
CADDR3
  Top 0.127: SV1.20 85.39,84.45 85.39,83.5 86.03,82.87 86.03,78.42 84.12,76.52 84.12,66.67 80,62.55 | IC6.7 80,62.55 | IC2.7 80,23.18 80,62.55
  Route15 0.127: IC10.24 100.95,102.55 100.95,95.25 92.7,87 86.67,87 SV1.20
  Bottom 0.127: IC4.7 27.29,21.27 50.79,21.27 | IC3.7 50.79,21.27 | 76.19,21.27 IC2.7 | 50.79,21.27 76.19,21.27 | IC1.7 101.59,21.27 76.19,21.27 | IC8.7 27.29,60.64 50.79,60.64 | IC7.7 50.79,60.64 | 76.19,60.64 IC6.7 | 50.79,60.64 76.19,60.64 | IC5.7 101.59,60.64 76.19,60.64
CADDR4  (via drill 0.25)
  Top 0.127: v89.52,101.92 88.25,100.65 88.25,86.04 SV1.22 87.94,84.45 87.94,83.5 88.57,82.87 88.57,80.96 89.84,79.69 v89.84,60.01 | IC3.6 53.33,19.37 53.33,55.56 IC7.6
  Bottom 0.127: IC4.6 27.29,18.73 50.79,18.73 | IC3.6 50.79,18.73 | 76.19,18.73 IC2.6 | 50.79,18.73 76.19,18.73 | IC1.6 101.59,18.73 76.19,18.73 | IC10.25 102.86,101.92 v89.52,101.92 | IC8.6 27.29,58.1 50.79,58.1 | IC7.6 50.79,58.1 | 76.19,58.1 IC6.6 | 50.79,58.1 76.19,58.1 | IC5.6 101.59,58.1 89.84,58.1 | 76.19,58.1 89.84,58.1 | 89.84,58.1 v89.84,60.01
CADDR5  (via drill 0.25)
  Top 0.127: v89.52,98.74 89.52,85.41 SV1.24 91.11,83.82 v91.11,55.88 | IC3.5 53.96,17.46 53.96,57.15 53.01,58.1 50.15,58.1 50.15,56.2 IC7.5
  Bottom 0.127: IC4.5 27.29,16.19 50.79,16.19 | IC3.5 50.79,16.19 | 76.19,16.19 IC2.5 | 50.79,16.19 76.19,16.19 | IC1.5 101.59,16.19 76.19,16.19 | IC10.26 103.49,100.01 100.64,100.01 99.36,98.74 v89.52,98.74 | IC8.5 27.29,55.56 50.79,55.56 | IC7.5 50.79,55.56 | 76.19,55.56 IC6.5 | 50.79,55.56 76.19,55.56 | IC5.5 101.59,55.56 91.11,55.56 | 76.19,55.56 91.11,55.56 | 91.11,55.56 v91.11,55.88
CADDR6  (via drill 0.25)
  Top 0.127: v92.7,90.17 92.38,89.85 SV1.26 | v109.21,76.52 106.03,73.34 v106.03,59.69
  Bottom 0.127: IC4.4 27.29,13.65 50.79,13.65 | IC3.4 50.79,13.65 | 76.19,13.65 IC2.4 | 50.79,13.65 76.19,13.65 | 76.19,13.65 101.59,13.65 IC1.4 112.7,22.86 112.7,53.02 106.03,53.02 | IC10.27 104.76,98.74 112.7,98.74 113.02,98.42 113.02,90.17 111.43,90.17 | v92.7,90.17 111.43,90.17 | IC8.4 27.29,53.02 50.79,53.02 | IC7.4 50.79,53.02 | 76.19,53.02 IC6.4 | 50.79,53.02 76.19,53.02 | 101.59,53.02 IC5.4 | 76.19,53.02 101.59,53.02 | 111.43,90.17 111.43,76.52 v109.21,76.52 | 106.03,53.02 v106.03,59.69 | 101.59,53.02 106.03,53.02
CADDR7  (via drill 0.25)
  Top 0.127: v98.09,90.81 94.92,87.63 SV1.28 | v109.53,90.81 111.43,88.9 v111.43,50.8 109.84,49.21 109.84,4.13 101.27,4.13 100.95,4.45 100.95,8.57 IC1.3
  Bottom 0.127: IC4.3 27.29,11.11 50.79,11.11 | IC3.3 50.79,11.11 | 76.19,11.11 IC2.3 | 50.79,11.11 76.19,11.11 | IC1.3 101.59,11.11 76.19,11.11 | 103.81,90.81 IC10.28 | v98.09,90.81 103.81,90.81 | IC8.3 27.29,50.48 50.79,50.48 | IC7.3 50.79,50.48 | 76.19,50.48 IC6.3 | 50.79,50.48 76.19,50.48 | 76.19,50.48 101.59,50.48 IC5.3 103.17,49.53 104.45,50.8 v111.43,50.8 | v109.53,90.81 103.81,90.81
CADDR8  (via drill 0.25)
  Top 0.127: v99.68,93.03 99.36,92.71 99.36,87 SV1.30 | IC10.1 112.06,94.61 v112.06,52.39 | IC1.25 84.44,15.56 v84.44,51.12
  Bottom 0.127: IC4.25 12.05,11.75 35.55,11.75 | IC3.25 35.55,11.75 | 60.95,11.75 IC2.25 | 35.55,11.75 60.95,11.75 | IC1.25 86.35,11.75 60.95,11.75 | IC10.1 110.48,96.2 102.54,96.2 99.68,93.34 v99.68,93.03 | IC8.25 12.05,51.12 35.55,51.12 | IC7.25 35.55,51.12 | 60.95,51.12 IC6.25 | 35.55,51.12 60.95,51.12 | 86.35,51.12 IC5.25 | 60.95,51.12 v84.44,51.12 86.35,51.12 | v112.06,52.39 111.11,51.44 104.13,51.44 103.81,51.12 86.35,51.12
CADDR9  (via drill 0.25)
  Top 0.127: v100.32,96.84 100.32,85.41 SV1.32 98.73,83.82 98.73,82.23 98.09,81.6 v98.09,54.93 89.84,46.67 89.84,17.78 IC1.24
  Bottom 0.127: IC4.24 12.05,14.29 35.55,14.29 | IC3.24 35.55,14.29 | 60.95,14.29 IC2.24 | 35.55,14.29 60.95,14.29 | IC1.24 86.35,14.29 60.95,14.29 | IC10.2 110.48,96.84 v100.32,96.84 | IC8.24 12.05,53.66 35.55,53.66 | IC7.24 35.55,53.66 | 60.95,53.66 IC6.24 | 35.55,53.66 60.95,53.66 | 60.95,53.66 86.35,53.66 IC5.24 97.78,54.61 v98.09,54.93
CADDR10  (via drill 0.25)
  Top 0.127: v101.59,99.38 101.59,87.63 102.54,86.68 SV1.34 101.27,83.82 101.27,78.42 98.73,75.88 v98.73,62.55 | IC1.21 88.89,21.27 88.89,19.68 88.57,19.37 85.08,19.37 85.08,60.01 IC5.21
  Bottom 0.127: IC4.21 12.05,21.91 35.55,21.91 | IC3.21 35.55,21.91 | 60.95,21.91 IC2.21 | 35.55,21.91 60.95,21.91 | IC1.21 86.35,21.91 60.95,21.91 | IC10.3 110.48,99.38 v101.59,99.38 | IC8.21 12.05,61.28 35.55,61.28 | IC7.21 35.55,61.28 | 60.95,61.28 IC6.21 | 35.55,61.28 60.95,61.28 | 60.95,61.28 86.35,61.28 IC5.21 98.41,62.23 v98.73,62.55
CADDR11  (via drill 0.25)
  Top 0.127: v106.35,102.23 105.4,101.28 105.4,94.3 104.45,93.34 104.45,85.72 SV1.36 105.72,84.45 105.72,83.5 106.35,82.87 106.35,75.56 104.76,73.98 v104.76,67.63 | IC4.23 14.28,20.95 v14.28,54.29
  Bottom 0.127: IC4.23 12.05,16.83 35.55,16.83 | IC3.23 35.55,16.83 | 60.95,16.83 IC2.23 | 35.55,16.83 60.95,16.83 | IC1.23 86.35,16.83 60.95,16.83 | IC10.4 110.8,102.23 v106.35,102.23 | IC8.23 12.05,56.2 14.28,56.2 | 35.55,56.2 14.28,56.2 | IC7.23 35.55,56.2 | 60.95,56.2 IC6.23 | 35.55,56.2 60.95,56.2 | 60.95,56.2 86.35,56.2 IC5.23 90.79,57.15 91.75,56.2 104.76,56.2 v104.76,67.63 | 14.28,56.2 v14.28,54.29
CADDR12  (via drill 0.25)
  Top 0.127: v109.21,103.19 107.62,101.6 SV1.38 | v104.13,81.6 104.13,48.58 IC5.2 | IC4.2 28.56,9.84 v28.56,46.67
  Bottom 0.127: IC4.2 27.29,8.57 50.79,8.57 | IC3.2 50.79,8.57 | 76.19,8.57 IC2.2 | 50.79,8.57 76.19,8.57 | IC1.2 101.59,8.57 76.19,8.57 | v109.21,103.19 IC10.5 | IC8.2 27.29,47.94 28.56,47.94 | 50.79,47.94 28.56,47.94 | IC7.2 50.79,47.94 | 76.19,47.94 IC6.2 | 50.79,47.94 76.19,47.94 | IC5.2 101.59,47.94 76.19,47.94 | SV1.38 106.98,84.45 106.03,84.45 105.4,83.82 104.76,83.82 103.81,82.87 103.81,81.6 v104.13,81.6 | 28.56,47.94 v28.56,46.67
CADDR13  (via drill 0.25)
  Top 0.127: IC10.6 109.84,106.36 109.84,93.34 110.16,93.03 110.16,92.39 108.89,91.12 108.89,77.15 105.4,73.66 v105.4,50.16 | SV1.2 63.17,83.82 63.17,78.42 63.49,78.11 63.49,51.12 | IC6.26 63.49,51.12 | IC2.26 63.49,11.75 63.49,51.12
  Bottom 0.127: IC4.26 12.05,9.21 35.55,9.21 | IC3.26 35.55,9.21 | 60.95,9.21 IC2.26 | 35.55,9.21 60.95,9.21 | IC1.26 86.35,9.21 60.95,9.21 | IC8.26 12.05,48.58 35.55,48.58 | IC7.26 35.55,48.58 | 60.95,48.58 IC6.26 | 35.55,48.58 60.95,48.58 | 86.35,48.58 IC5.26 | 60.95,48.58 86.35,48.58 | v105.4,50.16 103.81,48.58 86.35,48.58
CADDR14  (via drill 0.25)
  Top 0.127: R5.1 38.72,134.62 38.72,117.79 39.99,116.52 39.99,85.72 40.31,85.41 40.31,80.96 39.68,80.33 v39.68,45.72 | IC1.1 104.13,6.67 104.13,42.86 IC5.1
  Bottom 0.127: IC4.1 27.29,6.03 50.79,6.03 | IC3.1 50.79,6.03 | 76.19,6.03 IC2.1 | 50.79,6.03 76.19,6.03 | IC1.1 101.59,6.03 76.19,6.03 | R5.1 29.52,136.53 25.71,136.53 CADDR14.1 | IC8.1 27.29,45.4 39.68,45.4 | 50.79,45.4 39.68,45.4 | IC7.1 50.79,45.4 | 76.19,45.4 IC6.1 | 50.79,45.4 76.19,45.4 | IC5.1 101.59,45.4 76.19,45.4 | 39.68,45.4 v39.68,45.72
DEST-ADDR  (via drill 0.25)
  Top 0.127: v101.91,86.36 100.95,87.31 100.95,113.03 99.36,114.62 86.03,114.62 IC12.8 | JP1.4 59.36,86.36 59.36,94.3 59.04,94.61 v59.04,108.9
  Bottom 0.127: IC5.11 106.35,73.66 106.35,83.82 107.94,83.82 108.89,84.77 108.89,86.36 v101.91,86.36 | v59.04,108.9 81.27,108.9 85.39,113.03 IC12.8
FAULT
  Bottom 0.127: IC15.17 34.28,125.41 41.26,125.41 53.96,138.11 59.04,138.11 FAULT.A
GND
  Top 0.127: JP3.P$5 JP3.P$6 | 14.91,139.7 19.99,134.62 IC15.22 | 14.91,139.7 UCODE.3 | PWR.K 103.81,146.05 IC10.15 | START.2 14.91,149.86 14.91,139.7
  Bottom 0.127: START.2 21.9,149.86 23.17,151.13 32.69,151.13 LOCAL-CPU-RESET.1 | JP3.P$5 87.3,147.32 PWR.K
  pour Route2: 0.94,137.16 112.7,137.16 112.7,1.27 0.94,1.27
INT-EN  (via drill 0.25)
  Top 0.127: v93.02,78.74 94.92,80.64 SV1.27 | IC12.25 80,104.46 80,106.05 79.68,106.36 75.87,106.36 v75.87,83.82
  Bottom 0.127: 66.03,77.47 74.92,77.47 76.19,78.74 v93.02,78.74 | 66.03,77.47 IC6.15 | v75.87,83.82 75.87,80.01 68.57,80.01 66.03,77.47
INT-LD-HI  (via drill 0.25)
  Top 0.127: v90.48,71.44 90.48,81.92 SV1.23 88.57,83.82 88.57,85.41 88.89,85.72 v88.89,93.98 | IC12.23 81.59,107.95 v81.59,93.98
  Bottom 0.127: IC6.17 62.22,72.07 75.23,72.07 75.87,71.44 v90.48,71.44 | v88.89,93.98 v81.59,93.98
INT-LD-LO  (via drill 0.25)
  Top 0.127: v88.57,80.01 87.3,81.28 SV1.21 86.03,83.82 86.03,85.41 84.76,86.68 84.76,93.03 83.81,93.98 83.81,105.73 IC12.6
  Bottom 0.127: IC5.13 97.46,80.01 v88.57,80.01
INT-START  (via drill 0.25)
  Top 0.127: v91.75,75.25 92.38,75.88 SV1.25 | IC12.24 76.82,103.82 v76.82,87.95
  Bottom 0.127: IC6.16 62.22,74.61 75.23,74.61 75.87,73.98 90.16,73.98 91.43,75.25 v91.75,75.25 | v76.82,87.95 77.46,87.31 81.59,87.31 83.49,85.41 83.49,84.45 83.81,84.45 84.44,83.82 91.11,83.82 SV1.25
IO-ADDR0  (via drill 0.25)
  Top 0.127: v24.75,45.4 24.75,78.11 26.02,79.38 27.61,79.38 27.61,83.82 SV2.22 29.2,85.41 29.2,97.16 v33.96,101.92 | v56.19,107 55.87,106.68 v55.87,102.55
  Bottom 0.127: IC1.16 88.89,37.15 88.89,41.27 73.01,41.27 71.11,43.18 63.81,43.18 63.49,42.86 46.02,42.86 45.39,43.5 25.07,43.5 24.75,43.81 v24.75,45.4 | IC13.5 73.01,105.73 71.11,105.73 69.84,107 v56.19,107 | v55.87,102.55 55.23,101.92 v33.96,101.92
IO-ADDR1  (via drill 0.25)
  Top 0.127: v62.85,39.37 58.09,44.13 v58.09,67.94 | v31.1,68.9 30.15,69.85 30.15,83.82 SV2.24 31.42,89.53 v32.05,90.17 | v71.11,107.63 70.47,107 v70.47,98.11
  Bottom 0.127: IC1.17 80.95,39.37 v62.85,39.37 | v58.09,67.94 57.14,68.9 v31.1,68.9 | IC13.6 73.01,107.63 v71.11,107.63 | v70.47,98.11 70.47,97.47 66.66,93.66 60.63,93.66 57.14,90.17 v32.05,90.17
IO-ADDR2  (via drill 0.25)
  Top 0.127: v59.36,29.53 54.6,29.53 54.6,81.92 54.28,82.23 54.28,93.34 55.23,94.3 v55.23,108.27 | SV2.26 34.59,85.72 v34.59,108.27
  Bottom 0.127: IC1.18 86.35,29.53 v59.36,29.53 | 55.87,108.9 56.5,109.54 72.38,109.54 IC13.7 | 55.87,108.9 v55.23,108.27 | v34.59,108.27 35.23,108.9 55.87,108.9
IO-ADDR3  (via drill 0.25)
  Top 0.127: v50.15,26.99 29.2,26.99 29.2,68.9 28.25,69.85 v28.25,81.28 | IC13.8 69.52,109.22 v69.52,106.36 | v38.72,106.36 36.18,103.82 36.18,85.41 SV2.28
  Bottom 0.127: IC1.19 86.35,26.99 v50.15,26.99 | v28.25,81.28 34.28,81.28 35.23,82.23 35.23,85.09 SV2.28 | v38.72,106.36 v69.52,106.36
LD
  Top 0.127: IC15.19 29.83,129.22 29.83,139.38 39.99,149.54 50.47,149.54 LOADING.A
LD-INS-REG  (via drill 0.25)
  Top 0.127: v96.19,75.88 97.46,77.15 SV1.29 | IC12.26 80.63,98.11 80.63,93.98 79.68,93.03 v79.68,88.27
  Route15 0.127: v79.68,88.27 80.63,87.31 v82.86,87.31
  Bottom 0.127: IC6.13 78.09,75.88 v96.19,75.88 | v82.86,87.31 83.81,86.36 95.24,86.36 96.19,85.41 96.19,82.55 SV1.29
LED-READY
  Top 0.127: IC15.18 30.47,127.32 30.47,139.06 40.31,148.91 60.63,148.91 READY.A
N$1
  Top 0.127: R6.1 106.03,143.19 106.03,148.91 PWR.A
N$6  (via drill 0.25)
  Top 0.127: v39.36,121.92 42.85,125.41 Q1.2 42.85,125.73 C18.2
  Bottom 0.127: IC15.9 27.61,121.92 v39.36,121.92
N$7
  Top 0.127: C16.2 42.85,120.65 Q1.1
  Bottom 0.127: IC15.10 29.2,120.97 42.85,120.97 Q1.1
N$8
  Top 0.127: C19.1 DTR-RESET.2
N$17
  Top 0.127: IC15.21 20.94,125.41 20.94,113.98 C15.2
N$25
  Top 0.127: READY.K R8.1
N$26
  Top 0.127: LOADING.K R9.1
N$27
  Top 0.127: FAULT.K R7.1
N$30
  Top 0.127: IC15.23 11.1,133.35 UCODE.2
N$32
  Bottom 0.127: IC9.7 11.1,96.52 JP2.2
N$33
  Top 0.127: DTR-RESET.1 86.03,146.05 86.03,150.5 86.67,151.13 94.92,151.13 JP3.P$1
N$34
  Top 0.127: FTDI-VCC.2 89.84,148.59 87.3,148.59 JP3.P$4
N$39
  Top 0.127: R1.1 27.93,96.84 27.93,116.84 26.02,118.75 26.02,132.4 25.07,133.35 25.07,148.91 26.02,149.86 | IC15.25 10.15,129.22 10.15,146.05 15.23,151.13 26.02,151.13 26.02,149.86 | 26.02,149.86 START.1
OPERAND-CLK  (via drill 0.25)
  Top 0.127: IC6.11 80.31,73.03 v80.31,80.01 | v78.41,86.68 IC12.28
  Bottom 0.127: 80.95,80.64 v80.31,80.01 | 80.95,80.64 100.64,80.64 SV1.33 | v78.41,86.68 78.41,80.64 80.95,80.64
OUT-OFF  (via drill 0.25)
  Top 0.127: IC11.7 94.92,106.68 94.92,88.58 93.65,87.31 v93.65,83.82
  Route15 0.127: IC7.12 53.65,74.3 56.5,74.3 62.85,80.64 77.78,80.64 SV1.15
  Bottom 0.127: v93.65,83.82 93.65,81.28 80.95,81.28 SV1.15
OUT-ON  (via drill 0.25)
  Top 0.127: IC11.8 92.7,107 92.7,93.34 v90.16,90.81 | v74.6,89.53 73.33,88.27 73.33,72.39 74.6,71.12 74.6,70.48 74.28,70.17 70.79,70.17 v70.79,70.8
  Route2 0.127: v70.79,70.8 70.79,73.66 77.78,80.64 80.31,80.64 SV1.17
  Bottom 0.127: IC7.11 52.06,69.53 60,69.53 60.63,68.9 68.89,68.9 v70.79,70.8 | v90.16,90.81 88.89,89.53 v74.6,89.53
REG-LD-HI  (via drill 0.25)
  Top 0.127: IC3.17 39.04,35.56 SV2.29 | v38.09,104.78 36.82,103.5 36.82,86.68 v37.14,86.36
  Bottom 0.127: IC14.6 60.31,107.63 54.91,107.63 54.28,107 38.41,107 38.09,106.68 v38.09,104.78 | v37.14,86.36 37.77,85.72 37.77,82.55 SV2.29
REG-LD-ID0  (via drill 0.25)
  Top 0.127: v16.18,30.8 21.9,30.8 21.9,81.92 SV2.15 21.26,83.5 22.53,84.77 22.53,85.41 23.17,86.04 23.17,90.49 v27.93,95.25
  Bottom 0.127: IC4.18 11.42,30.8 v16.18,30.8 | IC14.27 52.69,97.47 30.15,97.47 v27.93,95.25
REG-LD-ID1  (via drill 0.25)
  Top 0.127: v18.09,28.89 24.44,28.89 24.44,44.77 23.8,45.4 SV2.17 25.07,83.82 25.07,90.49 27.29,92.71 v28.25,92.71
  Bottom 0.127: IC4.19 12.05,28.89 v18.09,28.89 | IC14.28 50.47,92.71 v28.25,92.71
REG-LD-ID2  (via drill 0.25)
  Top 0.127: IC3.11 46.66,35.56 46.66,44.77 44.76,46.67 v44.76,77.79 | v26.98,80.01 26.34,80.64 SV2.19 26.34,83.5 27.61,84.77 27.61,91.12 v28.56,92.08
  Bottom 0.127: v44.76,77.79 42.53,80.01 v26.98,80.01 | IC14.1 55.23,95.25 52.06,92.08 v28.56,92.08
REG-LD-ID3  (via drill 0.25)
  Top 0.127: v34.91,34.61 29.83,39.69 29.83,69.22 28.88,70.17 SV2.21 28.88,83.5 30.15,84.77 30.15,91.44 v32.05,93.34
  Bottom 0.127: IC3.12 50.15,34.61 v34.91,34.61 | IC14.2 59.68,96.84 39.68,96.84 36.18,93.34 v32.05,93.34
REG-LD-LO  (via drill 0.25)
  Top 0.127: v34.28,40.01 33.96,40.32 SV2.25 35.23,83.82 35.23,103.5 v35.55,103.82
  Bottom 0.127: IC3.15 34.59,40.01 v34.28,40.01 | IC14.4 60.31,103.19 54.91,103.19 54.28,103.82 v35.55,103.82
REG-RD-ID0  (via drill 0.25)
  Top 0.127: v23.8,38.1 23.17,38.73 v23.17,81.28
  Bottom 0.127: v23.8,38.1 IC4.13 | v23.17,81.28 12.37,81.28 SV2.7 9.83,83.82 4.75,83.82 4.75,101.92 5.38,102.55 18.72,102.55 23.8,107.63 52.69,107.63 IC14.23
REG-RD-ID1  (via drill 0.25)
  Top 0.127: IC4.15 13.01,40.01 13.01,81.92 SV2.9 | IC14.24 51.11,103.5 v51.11,89.53
  Bottom 0.127: v51.11,89.53 50.47,88.9 15.86,88.9 12.37,85.41 12.37,82.55 SV2.9
REG-RD-ID2  (via drill 0.25)
  Top 0.127: IC4.16 13.64,38.1 13.64,80.01 14.91,81.28 | SV2.11 14.91,81.28 | v27.29,102.55 18.4,93.66 18.4,88.9 14.91,85.41 14.91,81.28
  Bottom 0.127: IC14.25 52.69,102.55 v27.29,102.55
REG-RD-ID3  (via drill 0.25)
  Top 0.127: v16.18,38.1 18.72,40.64 SV2.13 19.99,83.82 19.99,85.41 20.94,86.36 20.94,93.66 v27.29,100.01
  Bottom 0.127: v16.18,38.1 IC4.17 | IC14.26 52.69,100.01 v27.29,100.01
SCL  (via drill 0.25)
  Top 0.127: R3.1 5.7,111.44 5.7,126.05 IC15.28 | IC9.6 14.59,103.19 14.59,104.78 v13.32,106.05
  Bottom 0.127: v13.32,106.05 10.15,109.22 R3.1 | 61.58,124.14 IC14.12 | 72.38,124.14 61.58,124.14 | IC13.12 72.38,124.14 | 85.08,124.14 IC12.12 | 72.38,124.14 85.08,124.14 | 97.78,124.14 IC11.12 | 85.08,124.14 97.78,124.14 | IC10.12 110.48,124.14 97.78,124.14 | IC15.28 7.93,123.83 51.42,123.83 51.74,124.14 61.58,124.14
SDA  (via drill 0.25)
  Top 0.127: IC15.27 6.34,126.05 6.34,107 R2.1 v5.7,101.92
  Bottom 0.127: IC9.5 18.4,101.92 v5.7,101.92 | 61.58,126.68 IC14.13 | 72.38,126.68 61.58,126.68 | IC13.13 72.38,126.68 | 85.08,126.68 IC12.13 | 72.38,126.68 85.08,126.68 | 97.78,126.68 IC11.13 | 85.08,126.68 97.78,126.68 | IC10.13 110.48,126.68 97.78,126.68 | IC15.27 9.83,124.46 49.52,124.46 51.74,126.68 61.58,126.68
SOFT-HALT  (via drill 0.25)
  Top 0.127: IC7.13 53.65,76.83 v53.65,83.5 | v84.12,107 82.86,105.73 v82.86,95.57 | v71.42,91.44 70.16,90.17 70.16,85.72 SV1.8
  Bottom 0.127: v53.65,83.5 53.65,87 67.61,87 SV1.8 | IC11.6 97.78,107 v84.12,107 | v82.86,95.57 81.9,94.61 80,94.61 76.82,91.44 v71.42,91.44
SPARE3  (via drill 0.25)
  Top 0.127: v56.5,75.25 56.19,75.56 56.19,81.92 JP1.1
  Route2 0.127: IC12.3 77.78,92.08 v77.78,88.27
  Bottom 0.127: IC5.17 86.35,73.34 72.06,73.34 71.42,73.98 59.68,73.98 58.41,75.25 v56.5,75.25 | v77.78,88.27 77.46,88.58 76.5,88.58 73.33,85.41 73.33,80.64 57.14,80.64 55.55,82.23 JP1.1
SRC-ADDR  (via drill 0.25)
  Top 0.127: IC6.18 58.09,73.66 JP1.3 | IC12.22 74.92,110.49 74.92,109.86 73.97,108.9 71.74,108.9 71.74,107.31 71.11,106.68 71.11,93.98 72.06,93.03 72.06,86.68 70.79,85.41 70.79,84.77 70.16,84.14 v70.16,83.82
  Bottom 0.127: v70.16,83.82 59.36,83.82 JP1.3
UCODE-COUNT-RESET  (via drill 0.25)
  Top 0.127: IC6.12 79.36,74.61 79.36,76.52 | 79.36,76.52 79.36,81.28 78.41,82.23 78.41,85.72 79.05,86.36 79.05,93.66 80,94.61 80,96.2 IC12.27 | SV1.31 98.73,81.28 v98.73,77.79 | 79.36,76.52 v79.68,76.52
  Bottom 0.127: v98.73,77.79 97.46,76.52 v79.68,76.52
VCC
  Top 0.127: UCODE.1 2.21,134.62 C17.2 | FTDI-VCC.1 91.11,139.7 IC11.15
  pour Route15: 0.94,1.27 0.94,137.16 112.7,137.16 112.7,1.27

## Text on the board
tNames: DOWN / LOAD | WRITE / MEM | WP | YACC1 SEQUENCER MEMORY BOARD 2.1 | www.onepagecomputer.com